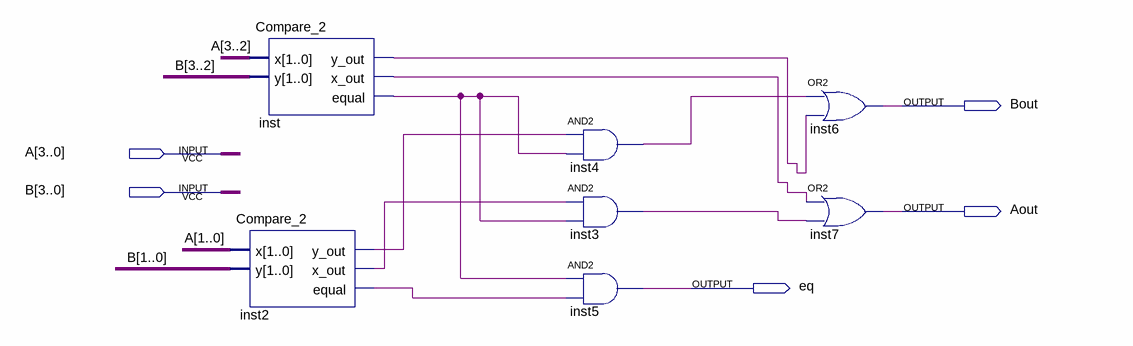
[diagram p0: schematic sheet]
// Quartus schematic Compare_4.bdf as structural Verilog: 7 symbols, 5 pins
module Compare_4 (
  input  [3:0] A,
  input  [3:0] B,
  output Bout,
  output Aout,
  output eq
);

  wire inst2_equal, inst2_x_out, inst2_y_out, inst3_out, inst4_out, inst_equal, inst_x_out, inst_y_out;

  Compare_2 inst (.x(A[3:2]), .y(B[3:2]), .y_out(inst_y_out), .x_out(inst_x_out), .equal(inst_equal));
  Compare_2 inst2 (.x(A[1:0]), .y(B[1:0]), .y_out(inst2_y_out), .x_out(inst2_x_out), .equal(inst2_equal));
  and inst4 (inst4_out, inst2_y_out, inst_equal);
  and inst3 (inst3_out, inst2_x_out, inst_equal);
  and inst5 (eq, inst_equal, inst2_equal);
  or inst6 (Bout, inst4_out, inst_y_out);
  or inst7 (Aout, inst_x_out, inst3_out);
endmodule
